# EAGLE design baby_monitor_v1 (EAGLE 9.6.2)

## Sheet 1 of 2: Power & antenna
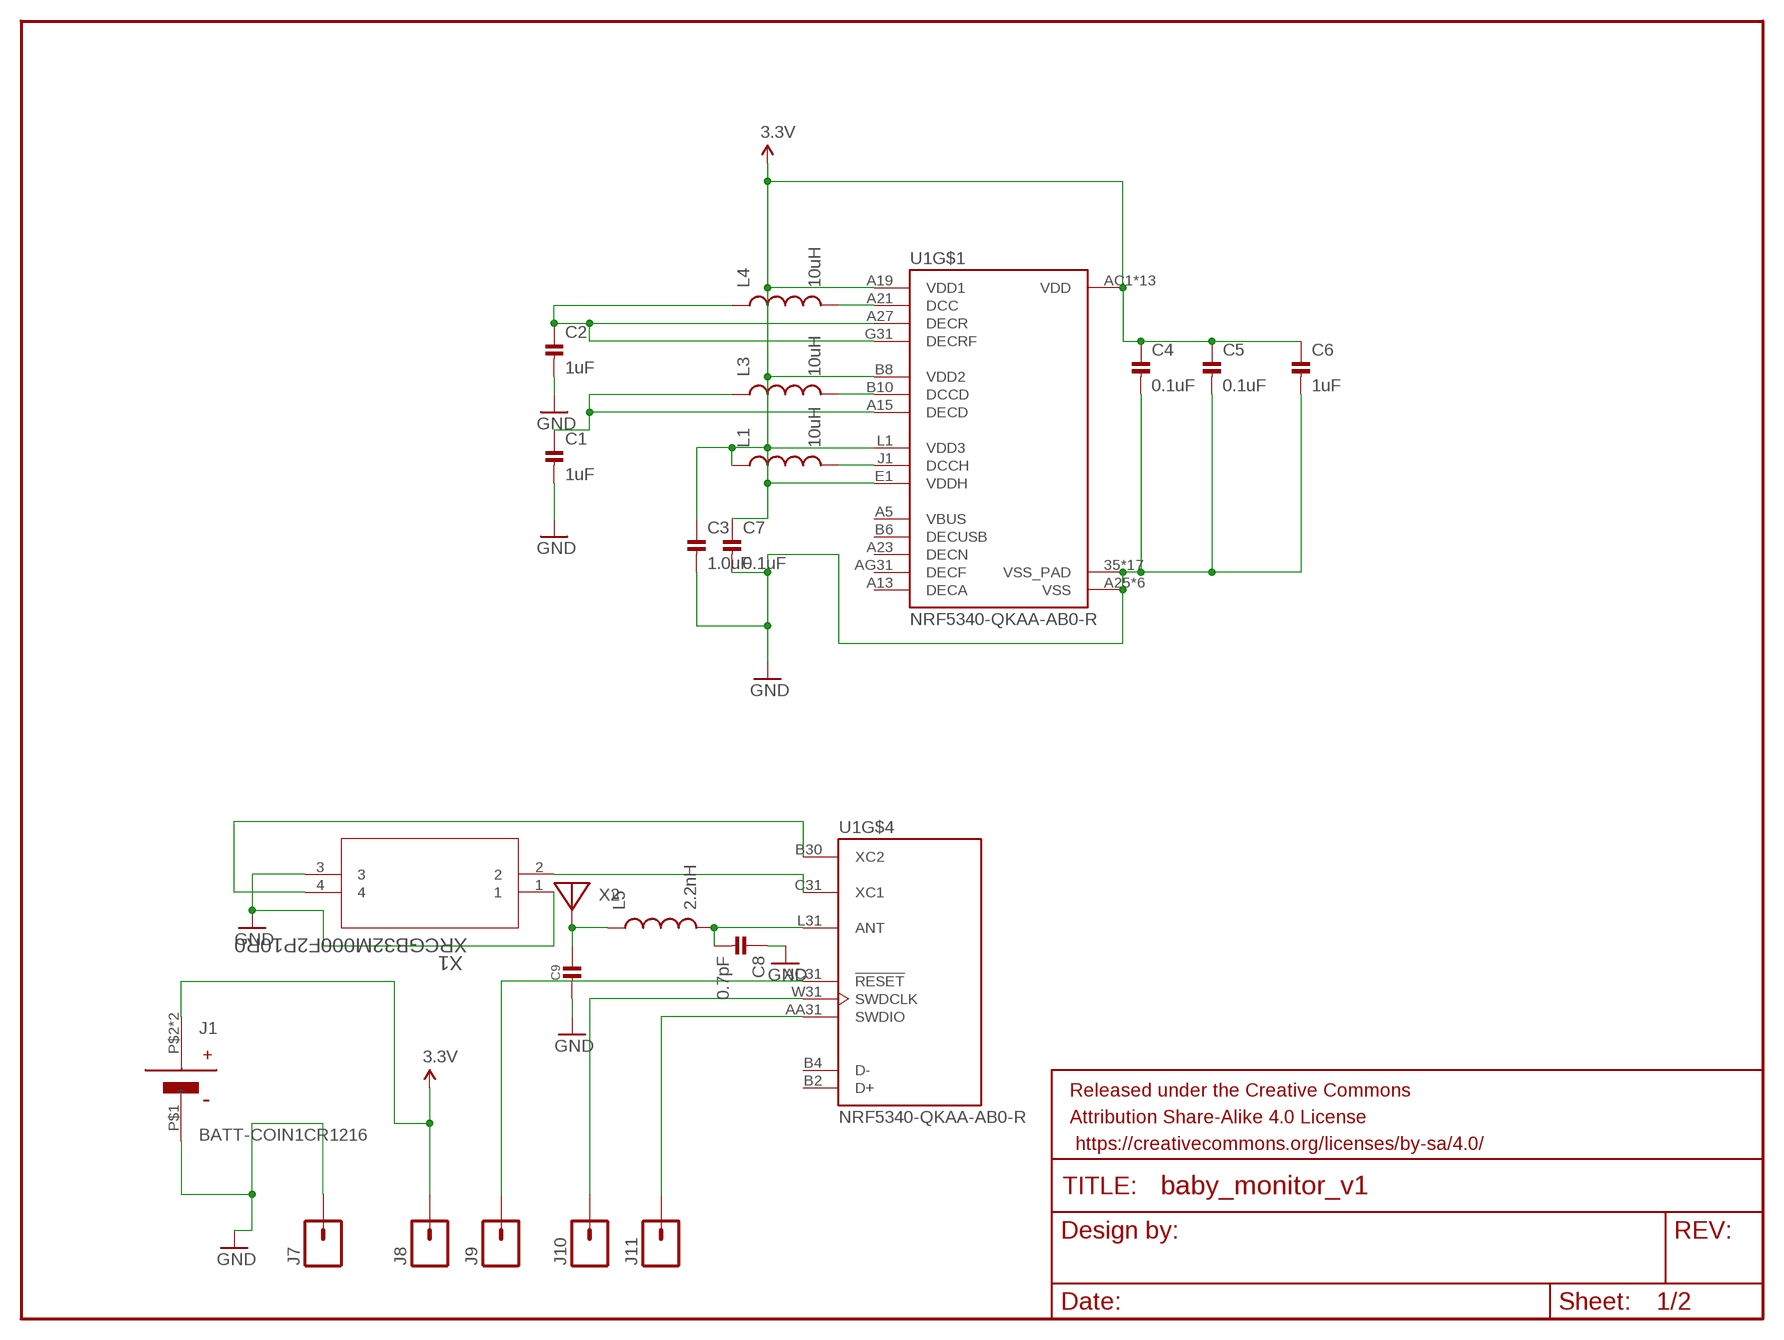
[diagram p0: schematic, sheet 1]

### Parts
C1  1uF  MICROBUILDER_CAP_CERAMIC_0402MP  [MICROBUILDER__0402MP]
C2  1uF  MICROBUILDER_CAP_CERAMIC_0402MP  [MICROBUILDER__0402MP]
C3  1.0uF  MICROBUILDER_CAP_CERAMIC_0402MP  [MICROBUILDER__0402MP]
C4  0.1uF  MICROBUILDER_CAP_CERAMIC_0402MP  [MICROBUILDER__0402MP]
C5  0.1uF  MICROBUILDER_CAP_CERAMIC_0402MP  [MICROBUILDER__0402MP]
C6  1uF  MICROBUILDER_CAP_CERAMIC_0402MP  [MICROBUILDER__0402MP]
C7  0.1uF  MICROBUILDER_CAP_CERAMIC_0402MP  [MICROBUILDER__0402MP]
C8  0.7pF  MICROBUILDER_CAP_CERAMIC_0402MP  [MICROBUILDER__0402MP]
C9  MICROBUILDER_CAP_CERAMIC_0402MP  [MICROBUILDER__0402MP]
FRAME1  FRAME-LETTERNO_PACKAGE  [DUMMY]
J1  BATT-COIN1CR1216  [BC-2017-TR]
J7  M01TINY  [1X01_TINY]
J8  M01TINY  [1X01_TINY]
J9  M01TINY  [1X01_TINY]
J10  M01TINY  [1X01_TINY]
J11  M01TINY  [1X01_TINY]
L1  10uH  NORDIC_MISC_INDUCTOR_0603_N  [NORDIC_MISC_RESC0603_N]
L3  10uH  NORDIC_MISC_INDUCTOR_0603_N  [NORDIC_MISC_RESC0603_N]
L4  10uH  NORDIC_MISC_INDUCTOR_0603_N  [NORDIC_MISC_RESC0603_N]
L5  2.2nH  NORDIC_MISC_INDUCTOR_0402_N  [NORDIC_MISC_RESC0402_N]
U1  NRF5340-QKAA-AB0-R  [XCVR_NRF5340-QKAA-AB0-R]
X1  XRCGB32M000F2P10R0  [XTAL_SON4_1P6X2P0_MUR]
X2  ADAFRUIT_WIRELESS_ANTENNA_JOHANSON_2450AT18B100  [ADAFRUIT_WIRELESS_ANT_2450AT18B100]

### Nets
3.3V: C3.1 C4.1 C5.1 C6.1 C7.1 J1.P$2(+) J1.P$3(+) J8.P$1 L1.1 U1.A19(VDD1) U1.AC1(VDD) U1.AG1(VDD) U1.AJ31(VDD) U1.AL3(VDD) U1.AL7(VDD) U1.AL11(VDD) U1.AL17(VDD) U1.AL25(VDD) U1.B8(VDD2) U1.B28(VDD) U1.C1(VDD) U1.E1(VDDH) U1.E31(VDD) U1.L1(VDD3) U1.N31(VDD) U1.U1(VDD) ; also sheet 2
GND: C1.2 C2.2 C3.2 C4.2 C5.2 C6.2 C7.2 C8.1 C9.2 J1.P$1(-) J7.P$1 U1.35(VSS_PAD) U1.36(VSS_PAD) U1.37(VSS_PAD) U1.38(VSS_PAD) U1.39(VSS_PAD) U1.40(VSS_PAD) U1.41(VSS_PAD) U1.43(VSS_PAD) U1.44(VSS_PAD) U1.45(VSS_PAD) U1.46(VSS_PAD) U1.47(VSS_PAD) U1.48(VSS_PAD) U1.49(VSS_PAD) U1.50(VSS_PAD) U1.51(VSS_PAD) U1.104(VSS_PAD) U1.A25(VSS) U1.B12(VSS) U1.B26(VSS) U1.G1(VSS) U1.H2(VSS) U1.J31(VSS) X1.1 X1.3 ; also sheet 2
N$4: L4.2 U1.A21(DCC)
N$5: L1.2 U1.J1(DCCH)
N$7: L3.2 U1.B10(DCCD)
N$8: C2.1 L4.1 U1.A27(DECR) U1.G31(DECRF)
N$9: C1.1 L3.1 U1.A15(DECD)
N$10: U1.C31(XC1) X1.2
N$11: U1.B30(XC2) X1.4
N$12: C8.2 L5.2 U1.L31(ANT)
N$13: C9.1 L5.1 X2.FP
RESET: J9.P$1 U1.AC31(!RESET)
SWDCLK: J10.P$1 U1.W31(SWDCLK)
SWDIO: J11.P$1 U1.AA31(SWDIO)
Unconnected: U1.B2(D+) U1.B4(D-)

## Sheet 2 of 2: Peripheral
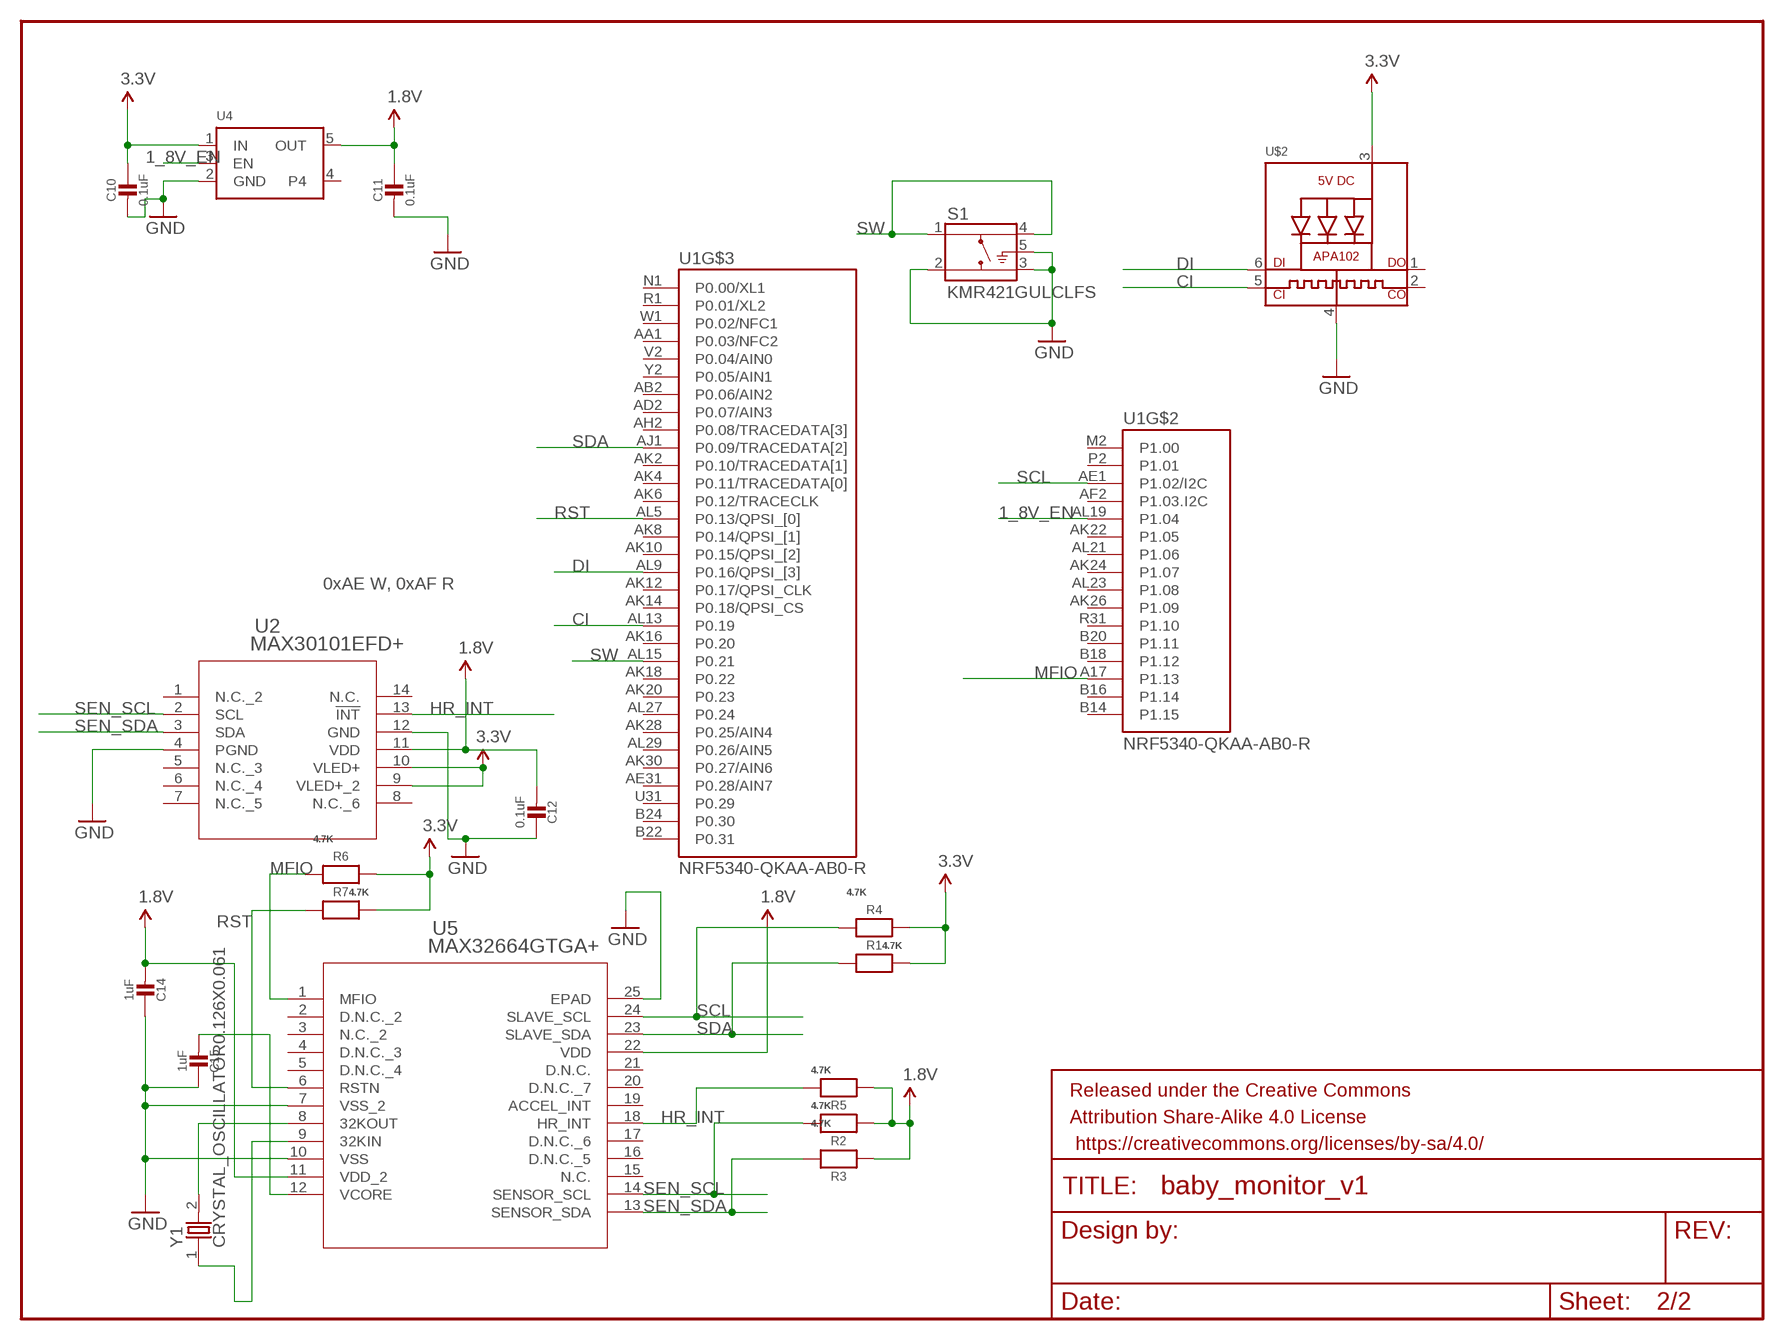
[diagram p1: schematic, sheet 2]

### Parts
C10  0.1uF  MICROBUILDER_CAP_CERAMIC_0402MP  [MICROBUILDER__0402MP]
C11  0.1uF  MICROBUILDER_CAP_CERAMIC_0402MP  [MICROBUILDER__0402MP]
C12  0.1uF  MICROBUILDER_CAP_CERAMIC_0402MP  [MICROBUILDER__0402MP]
C14  1uF  MICROBUILDER_CAP_CERAMIC_0402MP  [MICROBUILDER__0402MP]
C15  1uF  MICROBUILDER_CAP_CERAMIC_0402MP  [MICROBUILDER__0402MP]
FRAME2  FRAME-LETTERNO_PACKAGE  [DUMMY]
R1  4.7K  MICROBUILDER_RESISTOR_0402MP  [MICROBUILDER__0402MP]
R2  4.7K  MICROBUILDER_RESISTOR_0402MP  [MICROBUILDER__0402MP]
R3  4.7K  MICROBUILDER_RESISTOR_0402MP  [MICROBUILDER__0402MP]
R4  4.7K  MICROBUILDER_RESISTOR_0402MP  [MICROBUILDER__0402MP]
R5  4.7K  MICROBUILDER_RESISTOR_0402MP  [MICROBUILDER__0402MP]
R6  4.7K  MICROBUILDER_RESISTOR_0402MP  [MICROBUILDER__0402MP]
R7  4.7K  MICROBUILDER_RESISTOR_0402MP  [MICROBUILDER__0402MP]
S1  KMR421GULCLFS  [SW_KMR421GULCLFS]
U2  MAX30101EFD+  [21-0880B_MXM]
U4  MICROBUILDER_VREG_SOT23-5  [MICROBUILDER_SOT23-5]
U5  MAX32664GTGA+  [21-100264_90-100089_MXM]
U$2  MICROBUILDER_APA1022020  [MICROBUILDER_APA102_2020]
Y1  CRYSTAL_OSCILLATOR0.126X0.061  [QUARTZ]

### Nets
1.8V: C11.1 C12.2 C14.2 R2.1 R3.1 R5.1 U2.11(VDD) U4.5(OUT) U5.11(VDD_2) U5.22(VDD)
1_8V_EN: U1.AL19(P1.04) U4.3(EN)
3.3V: C10.1 R1.2 R4.2 R6.2 R7.2 U2.9(VLED+_2) U2.10(VLED+) U4.1(IN) U$2.3(VDD) ; also sheet 1
CI: U1.AL13(P0.19) U$2.5(CKI)
DI: U1.AL9(P0.16/QPSI_[3]) U$2.6(DI)
GND: C10.2 C11.2 C12.1 C14.1 C15.1 S1.2 S1.3 S1.5(G) U2.4(PGND) U2.12(GND) U4.2(GND) U5.7(VSS_2) U5.10(VSS) U5.25(EPAD) U$2.4(GND) ; also sheet 1
HR_INT: R5.2 U2.13(!INT) U5.18(HR_INT)
MFIO: R6.1 U1.A17(P1.13) U5.1(MFIO)
N$14: C15.2 U5.12(VCORE)
N$15: U5.8(32KOUT) Y1.2
N$16: U5.9(32KIN) Y1.1
RST: R7.1 U1.AL5(P0.13/QPSI_[0]) U5.6(RSTN)
SCL: R4.1 U1.AE1(P1.02/I2C) U5.24(SLAVE_SCL)
SDA: R1.1 U1.AJ1(P0.09/TRACEDATA[2]) U5.23(SLAVE_SDA)
SEN_SCL: R2.2 U2.2(SCL) U5.14(SENSOR_SCL)
SEN_SDA: R3.2 U2.3(SDA) U5.13(SENSOR_SDA)
SW: S1.1 S1.4 U1.AL15(P0.21)
Unconnected: U1.AA1(P0.03/NFC2) U1.AB2(P0.06/AIN2) U1.AD2(P0.07/AIN3) U1.AE31(P0.28/AIN7) U1.AF2(P1.03.I2C) U1.AH2(P0.08/TRACEDATA[3]) U1.AK2(P0.10/TRACEDATA[1]) U1.AK4(P0.11/TRACEDATA[0]) U1.AK6(P0.12/TRACECLK) U1.AK8(P0.14/QPSI_[1]) U1.AK10(P0.15/QPSI_[2]) U1.AK12(P0.17/QPSI_CLK) U1.AK14(P0.18/QPSI_CS) U1.AK16(P0.20) U1.AK18(P0.22) U1.AK20(P0.23) U1.AK22(P1.05) U1.AK24(P1.07) U1.AK26(P1.09) U1.AK28(P0.25/AIN4) U1.AK30(P0.27/AIN6) U1.AL21(P1.06) U1.AL23(P1.08) U1.AL27(P0.24) U1.AL29(P0.26/AIN5) U1.B14(P1.15) U1.B16(P1.14) U1.B18(P1.12) U1.B20(P1.11) U1.B22(P0.31) U1.B24(P0.30) U1.M2(P1.00) U1.N1(P0.00/XL1) U1.P2(P1.01) U1.R1(P0.01/XL2) U1.R31(P1.10) U1.U31(P0.29) U1.V2(P0.04/AIN0) U1.W1(P0.02/NFC1) U1.Y2(P0.05/AIN1) U2.1(N.C._2) U2.5(N.C._3) U2.6(N.C._4) U2.7(N.C._5) U2.8(N.C._6) U2.14(N.C.) U4.4 U5.2(D.N.C._2) U5.3(N.C._2) U5.4(D.N.C._3) U5.5(D.N.C._4) U5.15(N.C.) U5.16(D.N.C._5) U5.17(D.N.C._6) U5.19(ACCEL_INT) U5.20(D.N.C._7) U5.21(D.N.C.) U$2.1(DO) U$2.2(CKO)

### Notes on the sheet
- 0xAE W, 0xAF R

## Power pins joined to a net without a drawn wire
DECA: U1.A13(DECA)
DECF: U1.AG31(DECF)
DECN: U1.A23(DECN)
DECUSB: U1.B6(DECUSB)
VBUS: U1.A5(VBUS)

## Library data of the parts
C1-C8 C10-C12 C14 C15 = Adafruit Circuit Playground Bluefruit:MICROBUILDER_CAP_CERAMIC: Ceramic Capacitors For new designs, use the packages preceded by an '_' character since they are more reliable: The following footprints should be used on most boards: _0402 - Standard footprint for regular board layouts _0603 - Standard footprint for regular board layouts _0805 - Standard footprint for regular board layouts _1206 - Standard footprint for regular board layouts For extremely tight-pitch boards where space is at a premium, the following 'micro-pitch' footprints can be used (smaller pads, no silkscreen outline, etc.): _0402MP - Micro-pitch footprint for very dense/compact boards _0603MP - Micro-pitch footprint for very dense/compact boards _0805MP - Micro-pitch footprint for very dense/compact boards _1206MP - Micro-pitch footprint for very dense/compact boards
C9 = graftel-internal-ic:MICROBUILDER_CAP_CERAMIC: Ceramic Capacitors For new designs, use the packages preceded by an '_' character since they are more reliable: The following footprints should be used on most boards: _0402 - Standard footprint for regular board layouts _0603 - Standard footprint for regular board layouts _0805 - Standard footprint for regular board layouts _1206 - Standard footprint for regular board layouts For extremely tight-pitch boards where space is at a premium, the following 'micro-pitch' footprints can be used (smaller pads, no silkscreen outline, etc.): _0402MP - Micro-pitch footprint for very dense/compact boards _0603MP - Micro-pitch footprint for very dense/compact boards _0805MP - Micro-pitch footprint for very dense/compact boards _1206MP - Micro-pitch footprint for very dense/compact boards
FRAME1 FRAME2 = SparkFun-Aesthetics:FRAME-LETTER: Schematic Frame Standard 8.5x11 US Letter frame; DESIGNER: Nobody; VERSION: v01
J1 = graftel-internal-ic:BATT-COIN1: Digikey Part Number: BLP2032SM-GCT-ND link:https://www.digikey.com/product-detail/en/mpd-memory-protection-devices/BLP2032SM-GTR/BLP2032SM-GCT-ND/3628537
J7-J11 = graftel-internal-ic:M01: Header 1 Standard 1-pin 0.1" header. Use with straight break away headers (SKU : PRT-00116), right angle break away headers (PRT-00553), swiss pins (PRT-00743), machine pins (PRT-00117), and female headers (PRT-00115). SMTSO-256-ET is a "flush mount" nut for a 4-40 screw. The older package used to be too tight, and did not allow it to sit properly thru the drill hit. The latest (0.165DIA) fits nice and snug.
L1 L3-L5 = Adafruit Circuit Playground Bluefruit:NORDIC_MISC_INDUCTOR: Generic chip inductor
R1-R7 = Adafruit Circuit Playground Bluefruit:MICROBUILDER_RESISTOR: Resistors For new designs, use the packages preceded by an '_' character since they are more reliable: The following footprints should be used on most boards: _0402 - Standard footprint for regular board layouts _0603 - Standard footprint for regular board layouts _0805 - Standard footprint for regular board layouts _1206 - Standard footprint for regular board layouts For extremely tight-pitch boards where space is at a premium, the following 'micro-pitch' footprints can be used (smaller pads, no silkscreen outline, etc.): _0402MP - Micro-pitch footprint for very dense/compact boards _0603MP - Micro-pitch footprint for very dense/compact boards _0805MP - Micro-pitch footprint for very dense/compact boards _1206MP - Micro-pitch footprint for very dense/compact boards
S1 = graftel-internal-ic:KMR421GULCLFS: Switch Tactile N.O. SPST Round Button Gull Wing 0.05A 32VDC 1VA 200000Cycles 2N SMD Automotive T/R; DESCRIPTION: Tactile Switch SPST-NO Top Actuated Surface Mount; DIGI-KEY_PART_NUMBER: CKN12152CT-ND; MF: C&K; MP: KMR421GULCLFS; PACKAGE: None; PURCHASE-URL: https://pricing.snapeda.com/search/part/KMR421GULCLFS/?ref=eda
U1 = graftel-internal-ic:NRF5340-QKAA-AB0-R: IC RF; AVAILABILITY: Unavailable; DESCRIPTION: IC RF TxRx + MCU 802.15.4, Bluetooth Bluetooth v5.1, Thread, Zigbee® 2.4GHz; MF: Nordic Semiconductor; MP: nRF5340-QKAA-AB0-R; PACKAGE: None; PRICE: None
U2 = graftel-internal-ic:MAX30101EFD+; BUILT_BY: EMA_UL_Team; MANUFACTURER_PART_NUMBER: MAX30101EFD+; SOURCELIBRARY: Update_to_database_2021-01-13; VENDOR: Maxim Integrated Products
U4 = Adafruit Circuit Playground Bluefruit:MICROBUILDER_VREG_SOT23-5: SOT23-5 Fixed Voltage Regulators Part Current Out V Out V In V Dropout θJA (°C/W) TJ (°C) Digikey Part No. ADP121 150mA 3.3V 3.4-5.5V 0.09V @ 150mA -- -- ADP121-AUJZ33R7CT-ND ADP121 150mA 3.0V 3.1-5.5V 0.09V @ 150mA -- -- ADP121-AUJZ30R7CT-ND ADP122 300mA 3.3V 3.4-5.5V 0.085V @ 300mA -- -- ADP122AUJZ-3.3-R7CT-ND ADP1712 300mA 3.3V 3.5-5.5V 0.17V @ 300mA -- -- ADP1712AUJZ-3.3-R7TR-ND AP7311 (Low Cost) 150mA 3.3V 3.5-6V 0.15V @ 150mA -- -- AP7311-33WG-7DICT-ND LD39015M18R 150mA 1.8V 1.9V-5.5V 0.08V @ 100mA -- -- 497-6977-1-ND LP2985A-33DBVR 150mA 3.3V 3.3-16V 0.28V @ 150mA 206 150 296-18479-1-ND MCP1824T-3302E/OT 300mA 3.3V 3.5V-6V 0.2V @ 300mA -- -- MCP1824T-3302E/OTCT-ND MIC5205-2.5YM5 TR 150mA 2.5V 2.7-16V 0.165V @ 150mA -- -- 576-1257-2-ND MIC5205-3.0YM5 TR 150mA 3.0V 3.2V-16V 0.165V @ 150mA -- -- 576-1258-2-ND MIC5205-3.3YM5 TR 150mA 3.3V 3.5V-16V 0.165V @ 150mA -- -- 576-1259-2-ND TPS780330220 150mA 3.3V+2.2V 3.6-5.5V 250mV Max -- -- 296-23332-1-ND TDA3663/N1,135 100mA 3.3V 3.5-45V 0.18V @ 50mA -- -- 568-5343-1-ND Max operating temp can be calculated using θJA, TJ (max junction temperature), and power in watts. Set the "Maximum Ambient Temperature" until it reaches TJ ("Max Junction Temperature"), which is the absolute limit for safe use of the regulator: Heat Sink Temperature Calculator <http://www.daycounter.com/Calculators/Heat-Sink-Temperature-Calculator.phtml> For example, With 12V source into a 3.3V LP2985 and a 30mA load, we are dissipating (12V-3.3V) * 0.03A = 0.261W. With a θJA of 206 °C/W, a TJ of 150°C, and 261mW we can safely use the chip without a heat sink up to 75°C (=147.1°C Junction Temperature).
U5 = graftel-internal-ic:MAX32664GTGA+; BUILT_BY: EMA_Rebekah; COPYRIGHT: Copyright (C) 2018 Accelerated Designs. All rights reserved; MANUFACTURER_PART_NUMBER: MAX32664GTGA+; REVISION: 2; SOURCELIBRARY: Maxim_2020-02-10; VENDOR: Maxim Integrated Products
U$2 = graftel-internal-ic:MICROBUILDER_APA102: APA102/DotStar Pixels VCC: 5V DC Refresh Rate: 400Hz
X1 = graftel-internal-ic:XRCGB32M000F2P10R0; BUILT_BY: EMA_UL_Team; DIGIKEY_PART: 490-14308-1-ND; MANUFACTURER_PART_NUMBER: XRCGB32M000F2P10R0; SOURCELIBRARY: Murata_2017-08-09; VENDOR: Murata
X2 = graftel-internal-ic:ADAFRUIT_WIRELESS_ANTENNA_JOHANSON_2450AT18B100: Johanson 2.4GHz Chip Antenna (1206 Package) Frequency Range: 2400 - 2500 Mhz Peak Gain 0.5 dBi typ. (XZ-V) Average Gain -0.5 dBi typ. (XZ-V) Input Power 3W max. Operating Temperature -40 to +85°C Digikey: 712-1006-1-ND; DIGIKEY_PART: 712-1006-1-ND
Y1 = graftel-internal-ic:CRYSTAL_OSCILLATOR: SER4072CT-ND; PARTNO: SER4072CT-ND

## Board
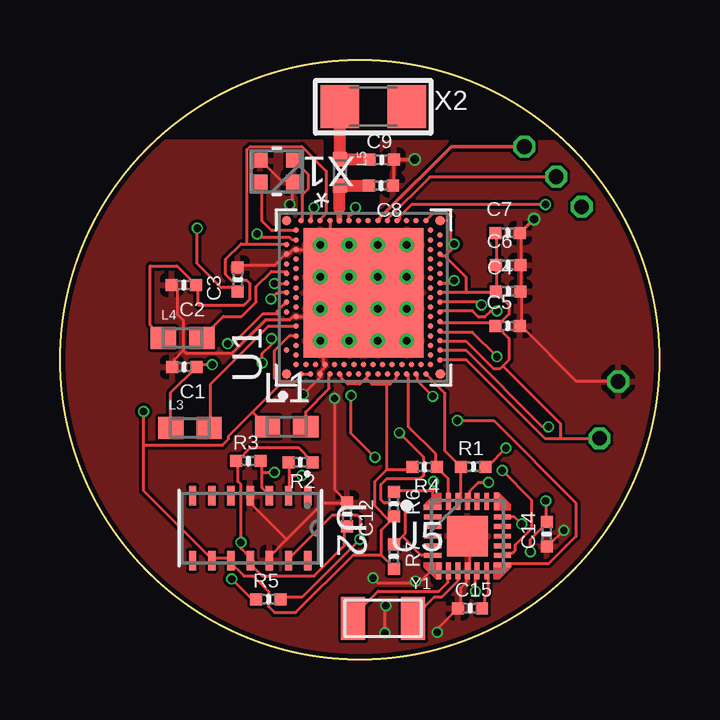
[diagram p2: board, top side]
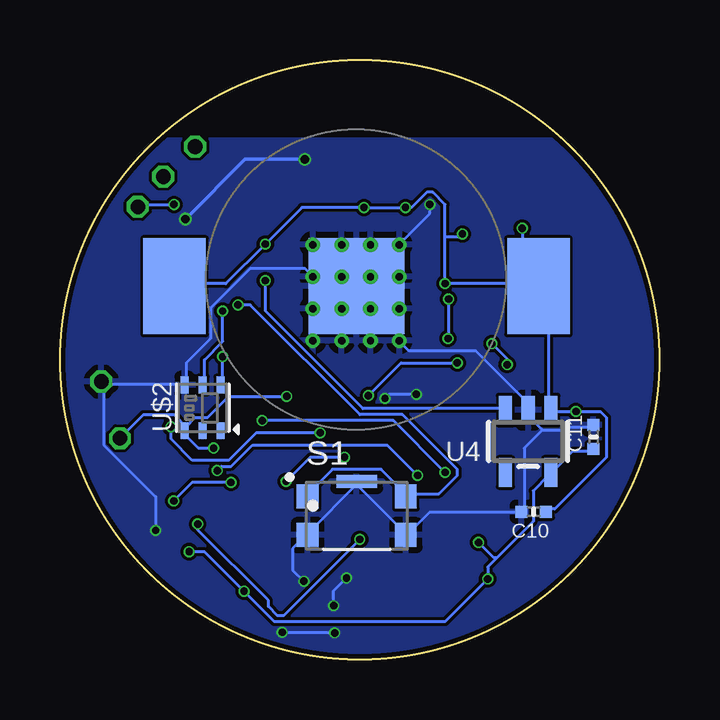
[diagram p3: board, bottom side, seen from below]

Size 25 x 25 mm. Coordinates in mm from the lower left corner, seen from the top.
Outline: circle at 12.5,12.5 radius 12.5
Copper layers (1*16): Top 0.035559375mm / dielectric 1.6mm / Bottom 0.035559375mm
Design rules "jlcpcb2layer": minimum track width 5mil, minimum drill 12mil, track to track 5mil, track to pad 5mil, pad to pad 5mil, via to via 5mil, smd to smd 5mil, copper to edge 8mil, drill to drill 6mil, minimum pad ring 5mil, minimum via ring 3mil, stop-mask expansion 2.5mil, vias tented up to drill 0mil, thermal gap 10mil

### Footprints (pad centres in the part's own frame; a part is rotated, then mirrored left to right if it is on the bottom)
MICROBUILDER__0402MP = smd 0.5 x 0.5: 1 -0.508,0; 2 0.508,0
BC-2017-TR = smd 4 x 4: P$1 0,0 | smd 2.6 x 4: P$2 -7.59,0; P$3 7.59,0
1X01_TINY = drill 0.61 octagon: P$1 0,0
NORDIC_MISC_RESC0603_N = smd 1.05 x 0.9: 1 -0.8,0; 2 0.8,0
NORDIC_MISC_RESC0402_N = smd 0.6 x 0.6: 1 -0.55,0; 2 0.55,0
SW_KMR421GULCLFS = smd 0.9 x 1: 1 -2.05,0.8; 2 -2.05,-0.8; 3 2.05,-0.8; 4 2.05,0.8 | smd 1.7 x 0.55: 5 0,1.425
XCVR_NRF5340-QKAA-AB0-R = drill 0.305 pad 0.61: 35 -1.8,-1.8; 36 -0.467,-1.8; 37 0.867,-1.8; 38 2.2,-1.8; 39 -1.8,-0.6; 40 -0.467,-0.6; 41 0.867,-0.6; 43 2.2,-0.6; 44 -1.8,0.6; 45 -0.467,0.6; 46 0.867,0.6; 47 2.2,0.6; 48 -1.8,1.8; 49 -0.467,1.8; 50 0.867,1.8; 51 2.2,1.8 | smd 5.4 x 5: 104 0.2,0 | smd 0.4 x 0.4: A1 -3.2,3.2; A31 3.2,3.2; AL1 -3.2,-3.2; AL31 3.2,-3.2 | smd 0.225 x 0.225: A5 -2.2,3.2; A13 -0.6,3.2; A15 -0.2,3.2; A17 0.2,3.2; A19 0.6,3.2; A21 1,3.2; A23 1.4,3.2; A25 1.8,3.2; A27 2.2,3.2; AA1 -3.2,-1; AA31 3.2,-1; AB2 -2.8,-1.2; AC1 -3.2,-1.4; AC31 3.2,-1.4; AD2 -2.8,-1.6; AE1 -3.2,-1.8; AE31 3.2,-1.8; AF2 -2.8,-2; AG1 -3.2,-2.2; AG31 3.2,-2.2; AH2 -2.8,-2.4; AJ1 -3.2,-2.6; AJ31 3.2,-2.6; AK2 -2.8,-2.8; AK4 -2.4,-2.8; AK6 -2,-2.8; AK8 -1.6,-2.8; AK10 -1.2,-2.8; AK12 -0.8,-2.8; AK14 -0.4,-2.8; AK16 0,-2.8; AK18 0.4,-2.8; AK20 0.8,-2.8; AK22 1.2,-2.8; AK24 1.6,-2.8; AK26 2,-2.8; AK28 2.4,-2.8; AK30 2.8,-2.8; AL3 -2.6,-3.2; AL5 -2.2,-3.2; AL7 -1.8,-3.2; AL9 -1.4,-3.2; AL11 -1,-3.2; AL13 -0.6,-3.2; AL15 -0.2,-3.2; AL17 0.2,-3.2; AL19 0.6,-3.2; AL21 1,-3.2; AL23 1.4,-3.2; AL25 1.8,-3.2; AL27 2.2,-3.2; AL29 2.6,-3.2; B2 -2.8,2.8; B4 -2.4,2.8; B6 -2,2.8; B8 -1.6,2.8; B10 -1.2,2.8; B12 -0.8,2.8; B14 -0.4,2.8; B16 0,2.8; B18 0.4,2.8; B20 0.8,2.8; B22 1.2,2.8; B24 1.6,2.8; B26 2,2.8; B28 2.4,2.8; B30 2.8,2.8; C1 -3.2,2.6; C31 3.2,2.6; D2 -2.8,2.4; E1 -3.2,2.2; E31 3.2,2.2; F2 -2.8,2; G1 -3.2,1.8; G31 3.2,1.8; H2 -2.8,1.6; J1 -3.2,1.4; J31 3.2,1.4; K2 -2.8,1.2; L1 -3.2,1; L31 3.2,1; M2 -2.8,0.8; N1 -3.2,0.6; N31 3.2,0.6; P2 -2.8,0.4; R1 -3.2,0.2; R31 3.2,0.2; T2 -2.8,0; U1 -3.2,-0.2; U31 3.2,-0.2; V2 -2.8,-0.4; W1 -3.2,-0.6; W31 3.2,-0.6; Y2 -2.8,-0.8
21-0880B_MXM = smd 0.813 x 0.305: 1 -1.346,2.4; 2 -1.346,1.6; 3 -1.346,0.8; 4 -1.346,0; 5 -1.346,-0.8; 6 -1.346,-1.6; 7 -1.346,-2.4; 8 1.346,-2.4; 9 1.346,-1.6; 10 1.346,-0.8; 11 1.346,0; 12 1.346,0.8; 13 1.346,1.6; 14 1.346,2.4
MICROBUILDER_SOT23-5 = smd 0.55 x 1.2: 1 -0.95,-1.3; 2 0,-1.3; 3 0.95,-1.3; 4 0.95,1.3; 5 -0.95,1.3
21-100264_90-100089_MXM = smd 0.711 x 0.203: 1 -1.45,1.2; 2 -1.45,0.8; 3 -1.45,0.4; 4 -1.45,0; 5 -1.45,-0.4; 6 -1.45,-0.8; 13 1.45,-1.2; 14 1.45,-0.8; 15 1.45,-0.4; 16 1.45,0; 17 1.45,0.4; 18 1.45,0.8 | smd 0.203 x 0.711: 7 -1.2,-1.45; 8 -0.8,-1.45; 9 -0.4,-1.45; 10 0,-1.45; 11 0.4,-1.45; 12 0.8,-1.45; 19 1.2,1.45; 20 0.8,1.45; 21 0.4,1.45; 22 0,1.45; 23 -0.4,1.45; 24 -0.8,1.45 | smd 1.702 x 1.702: 25 0,0
MICROBUILDER_APA102_2020 = smd 0.7 x 0.35: 1 -0.95,-0.75; 2 -0.95,0; 3 -0.95,0.75; 4 0.95,0.75; 5 0.95,0; 6 0.95,-0.75
XTAL_SON4_1P6X2P0_MUR = smd 0.61 x 0.61: 1 -0.699,0.45; 2 -0.699,-0.45; 3 0.699,-0.45; 4 0.699,0.45
ADAFRUIT_WIRELESS_ANT_2450AT18B100 = smd 1.6 x 1.8: FP -1.4,0; NC 1.4,0
QUARTZ = smd 1 x 1.8: 1 -1.25,0; 2 1.25,0

### Placement (x,y rotation side)
C1  5.19,12.2 180 top
C2  5.17,15.62 180 top
C3  7.41,15.84 90 top
C4  18.69,15.35 0 top
C5  18.67,13.91 0 top
C6  18.68,16.45 0 top
C7  18.67,17.79 0 top
C8  13.39,19.76 180 top
C9  13.41,20.84 0 top
C10  5.25,6.16 180 bottom
C11  2.76,9.28 90 bottom
C12  11.97,6.05 270 top
C14  20.3,5.24 90 top
C15  17.09,2.14 0 top
FRAME1  6.66,-19.25 0 top  (outside the outline)
FRAME2  5.64,-20.27 0 top  (outside the outline)
J1  12.64,15.57 0 bottom
J7  23.27,11.59 0 top
J8  22.5,9.23 0 top
J9  21.76,18.88 0 top
J10  19.36,21.39 0 top
J11  20.69,20.14 0 top
L1  9.45,9.71 0 top
L3  5.42,9.66 0 top
L4  5.11,13.41 0 top
L5  11.68,20.31 270 top
R1  17.23,8.04 0 top
R2  10.03,8.23 180 top
R3  7.85,8.28 0 top
R4  15.2,8.03 180 top
R5  8.69,2.52 0 top
R6  13.92,6.48 270 top
R7  13.92,4.3 270 top
S1  12.63,6 0 bottom
U1  12.65,15.1 90 top
U2  7.93,5.48 270 top
U4  5.48,9.1 180 bottom
U5  16.99,5.15 0 top
U$2  19.05,10.49 90 bottom
X1  9.04,20.36 180 top
X2  13.06,23.05 0 top
Y1  13.47,1.72 180 top

### Tracks (layer width: path | path; a pad name or v marks a point on that pad's centre or on a via)
1.8V  (via drill 0.3)
  Top 0.127: R2.1 10.47,8.31 9.96,8.82 7.93,8.82 7.42,8.31 R3.1 7.42,8.18 7.42,7.42 7.55,7.29 v7.55,4.88 7.55,4.63 7.93,4.25 U2.11 8.05,4.12 8.05,3.86 8.44,3.48 10.6,3.48 11.87,4.75 11.87,5.52 C12.2 | v7.17,3.36 7.93,2.59 8.18,2.59 R5.1 | v17.33,2.85 17.33,3.61 U5.11 | v19.61,4.5 19.61,5.01 20.25,5.64 C14.2 20.25,5.77 v20.25,6.62 | U5.22 17.1,6.71 17.1,7.03 17.45,7.39 v17.87,7.39
  Bottom 0.127: 6.79,4.25 5.26,5.77 5.26,7.04 4.63,7.67 U4.5 4.5,7.8 3.61,8.69 2.85,8.69 C11.1 | 6.79,4.25 7.17,3.86 v7.17,3.36 8.94,1.58 16.06,1.58 v17.33,2.85 18.98,4.5 v19.61,4.5 | v7.55,4.88 6.91,4.25 6.79,4.25 | v17.87,7.39 19.48,7.39 v20.25,6.62
1_8V_EN  (via drill 0.3)
  Top 0.127: v16.44,15.8 16.31,15.68 15.93,15.68 U1.AL19
  Bottom 0.127: v16.44,15.8 16.44,14.53 12.37,10.47 6.53,10.47 U4.3
3.3V  (via drill 0.3)
  Top 0.127: 12.75,11.74 12.88,11.87 U1.U1 | 12.75,11.74 12.5,11.48 11.99,11.48 11.74,11.74 11.74,11.87 11.71,11.9 U1.L1 | 13.64,11.48 13.01,11.48 12.75,11.74 | 13.64,11.48 13.77,11.48 14.02,11.74 14.02,11.87 U1.AC1 | 13.39,4.37 13.9,3.86 R7.2 | 13.39,4.37 13.39,5.39 13.77,5.77 | 13.77,5.77 13.9,5.9 R6.2 13.77,5.77 | 13.64,7.93 14.66,7.93 R4.2 | 13.64,7.93 13.14,7.42 13.14,6.4 13.77,5.77 | 13.64,7.93 13.64,11.48 | 9.2,11.48 8.94,11.74 8.94,12.88 9.58,13.52 9.83,13.52 U1.B8 | 9.2,11.48 9.71,11.48 10.09,11.87 U1.C1 U1.E1 | 3.48,8.94 3.48,7.04 6.28,4.25 U2.9 6.4,4.25 7.04,4.25 U2.10 7.04,4.12 7.67,3.48 8.05,3.48 8.69,2.85 8.69,2.21 8.94,1.96 9.83,1.96 12.25,4.37 13.39,4.37 | 3.48,8.94 v3.48,10.34 | 8.08,10.37 7.04,9.32 7.04,9.2 6.79,8.94 3.48,8.94 | 8.08,10.37 9.2,11.48 | 18.47,12.25 18.72,12.5 18.72,13.39 18.21,13.9 C5.1 | 18.47,12.25 18.34,12.12 18.09,12.12 16.95,13.26 15.93,13.26 U1.AL7 | U1.AL11 15.93,14.02 18.09,14.02 C5.1 | 16.95,15.29 18.09,15.29 C4.1 | 16.95,15.29 15.93,15.29 U1.AL17 | 16.06,16.82 15.93,16.82 U1.AL25 | 16.06,16.82 16.95,15.93 16.95,15.29 | 16.31,17.33 16.31,17.07 16.06,16.82 | 16.31,17.33 16.31,18.47 16.06,18.72 15.68,18.72 15.29,18.34 U1.AJ31 | C4.1 18.21,15.42 18.21,16.44 C6.1 18.21,16.56 18.21,17.71 C7.1 | C5.1 18.21,14.02 18.34,14.02 18.72,14.41 18.72,14.79 18.21,15.29 C4.1 | v15.55,10.98 14.91,11.61 14.91,11.87 U1.AG1 | v18.6,8.82 17.83,8.05 R1.2 | 20.88,9.2 22.41,9.2 J8.P$1 | 20.88,9.2 20.25,9.2 16.95,12.5 15.93,12.5 U1.AL3 | 18.47,12.25 20.88,9.83 20.88,9.2 | v8.94,15.68 9.45,15.68 U1.A19 | v10.6,18.85 10.47,18.72 10.47,18.34 U1.E31 | v16.44,17.33 16.31,17.33 | U1.B28 9.68,17.5 9.58,17.6 8.37,17.6 v8.22,17.75
  Top 0.127: U1.N31 12.05,18.53 arc90 12.32,18.8 v12.32,18.85 | L1.1 8.08,10.28 8.08,10.37 | C3.1 7.24,15.51 6.73,15.51 5.73,16.51 v5.73,17.98
  Bottom 0.127: v15.55,10.98 17.96,10.98 18.85,10.09 19.36,10.09 19.74,9.71 | 19.74,9.71 19.87,9.58 U$2.3 | v18.6,8.82 19.23,8.82 19.87,9.45 U$2.3 | 19.74,9.71 20.25,10.21 21.52,10.21 22.41,9.32 J8.P$1 | 19.74,9.71 U$2.3 | C10.1 4.63,6.28 4.37,6.28 2.21,8.44 2.21,10.09 2.47,10.34 v3.48,10.34 4.5,10.34 U4.1 4.63,10.47 4.63,15.17 5.01,15.55 J1.P$3 | J1.P$3 5.13,15.68 v8.94,15.68 8.94,17.61 | 8.94,17.61 8.94,18.98 9.45,19.48 9.71,19.48 10.34,18.85 v10.6,18.85 v12.32,18.85 14.91,18.85 v16.44,17.33 18.09,15.68 20.12,15.68 J1.P$2 | v8.22,17.75 8.36,17.61 8.94,17.61 | v5.73,17.98 5.73,16.25 J1.P$3
CI  (via drill 0.3)
  Top 0.127: v18.21,14.53 17.96,14.53 17.71,14.28 17.45,14.28 17.2,14.53 15.93,14.53 U1.AL13
  Bottom 0.127: v18.21,14.53 18.21,13.26 18.98,12.5 18.98,11.48 U$2.5
DI  (via drill 0.3)
  Top 0.127: v18.21,12.63 17.2,13.64 15.93,13.64 U1.AL9
  Bottom 0.127: v18.21,12.63 18.21,11.48 U$2.6
GND  (via drill 0.3, 0.35)
  Top 0.127: v21.01,5.39 20.37,4.75 C14.1 | C8.1 13.9,19.87 13.9,20.75 C9.2 | C7.2 19.23,17.71 19.23,16.56 C6.2 19.23,16.44 19.23,15.42 C4.2 19.23,15.29 19.23,14.02 C5.2 19.23,13.9 21.52,11.61 23.17,11.61 J7.P$1 | U5.25 17.07,5.13 17.07,3.74 U5.10 16.95,3.61 16.95,3.23 16.69,2.98 16.69,2.21 C15.1 15.73,1.29 v15.73,1.13 | U5.7 15.8,3.74 15.52,3.74 14.98,3.2 14.81,3.2 | 9.45,5.01 8.69,4.25 U2.12 | 9.45,5.01 10.98,6.53 11.87,6.53 C12.1 11.45,7.09 v11.45,10.89 | 9.45,5.01 8.05,6.4 8.05,6.79 U2.4 | 5.13,12.88 4.75,12.5 4.75,12.25 C1.2 | 5.13,12.88 5.13,14.15 4.88,14.41 4.88,15.42 4.75,15.55 C2.2 | X1.3 8.44,20.75 9.2,19.99 9.71,19.99 X1.1 9.71,19.87 9.71,19.1 v9.58,18.98 | 9.45,16.95 9.58,16.95 9.71,17.07 9.83,17.07 U1.B26 9.96,17.07 10.72,17.07 10.85,17.2 U1.104 | 10.85,14.53 10.6,14.28 9.96,14.28 U1.B12 9.83,14.28 9.71,14.28 9.58,14.15 8.56,14.15 7.17,12.75 5.26,12.75 5.13,12.88 | 10.98,13.26 10.98,12.37 U1.H2 11.1,12.25 10.85,11.99 U1.G1 10.85,11.77 v10.14,11.06 | 9.45,16.95 8.94,16.44 7.42,16.44 C3.2 | 9.45,16.95 U1.A25 | 10.98,13.26 U1.48 | 10.98,13.26 U1.104 | U1.104 11.48,13.9 11.99,13.39 U1.44 12.12,13.39 13.14,13.39 U1.39 13.26,13.39 14.41,13.39 U1.35 | 10.85,14.53 U1.49 | 10.85,14.53 U1.104 | U1.45 12.12,14.66 U1.104 | U1.104 12.63,15.17 13.14,14.66 U1.40 13.26,14.66 14.41,14.66 U1.36 | U1.50 10.98,16.06 11.48,16.56 U1.104 | U1.46 11.99,16.06 U1.104 | U1.104 10.98,17.33 U1.51 arc90 11.25,17.7 U1.J31 | U1.104 11.48,16.69 11.99,17.2 U1.47 12.12,17.33 13.14,17.33 U1.43 13.26,17.33 14.41,17.33 U1.38 | 13.26,16.06 14.41,16.06 U1.37 | 13.26,16.06 U1.41 | 13.26,16.06 U1.104 | v13.55,1.11 13.55,2.2 v13.59,2.24
  Top 0.127: v13.05,3.4 13.26,3.2 14.81,3.2 | v14.83,3.27 14.83,3.22 14.81,3.2
  Top 0.152: C9.2 14.77,20.84 v14.79,20.86 | v19.76,18.37 19.75,18.37 C7.2
  Bottom 0.127: v21.01,5.39 21.01,6.79 23.17,8.94 23.17,11.48 | 23.17,11.48 19.87,11.48 U$2.4 19.74,11.48 19.74,12.37 18.72,13.39 18.72,14.66 17.07,16.31 14.79,16.31 14.53,16.06 U1.37 | 23.17,11.48 J7.P$1 | 4.88,9.58 4.12,9.58 3.99,9.71 2.85,9.71 C11.2 | 4.88,9.58 5.39,10.09 5.39,10.34 U4.2 5.52,10.47 5.52,10.72 7.67,12.88 10.47,12.88 10.85,13.26 U1.48 | 4.88,9.58 5.64,8.82 5.64,6.28 C10.2 5.77,6.15 9.58,6.15 10.47,5.26 S1.3 10.6,5.26 12.63,7.29 | S1.5 12.63,7.29 | 12.63,7.29 14.66,5.26 S1.2 14.79,5.13 15.29,4.63 15.29,3.73 v14.83,3.27 | U1.41 13.14,15.93 12.75,15.55 J1.P$1 | v9.58,18.98 9.58,18.6 10.85,17.33 U1.51 | v15.73,1.13 13.57,1.13 v13.55,1.11 | v13.59,2.24 13.59,2.87 v13.05,3.4 | v10.14,11.06 11.28,11.06 v11.45,10.89
  Bottom 0.152: v14.79,20.86 17.27,20.86 v19.76,18.37
  pour Top: -0.25,21.64 10.93,21.64 10.93,17.78 12.32,17.78 13.41,17.78 13.41,21.62 27.49,21.62 27.49,-0.35 -0.35,-0.35 -0.35,21.54 -0.35,21.64 -0.28,21.64
  pour Bottom: -0.35,21.69 27.51,21.69 27.51,-0.33 -0.35,-0.33
HR_INT  (via drill 0.3)
  Top 0.127: R5.2 9.2,2.59 10.09,2.59 v12.5,5.01 12.5,5.9 12.37,6.02 11.36,6.02 9.58,4.25 U2.13 | v19.26,5.65 18.96,5.95 U5.18
  Bottom 0.127: v12.5,5.01 15.68,1.83 15.93,1.83 16.31,2.21 16.31,2.47 19.26,5.41 v19.26,5.65
MFIO  (via drill 0.3)
  Top 0.127: v8.82,13.39 8.82,13.13 8.44,12.75 v8.44,12.37 | v12.14,11 12.14,9.43 v13.14,8.44 | 15.55,7.04 15.55,6.4 U5.1 | U1.A17 9.16,15.29 9.12,15.26 9.02,15.26 v8.8,15.03 | 15.55,7.04 14.02,7.04 R6.1 | v15.57,7.43 15.57,7.06 15.55,7.04
  Bottom 0.127: v8.44,12.37 10.77,12.37 v12.14,11 | v8.8,15.03 8.8,13.41 v8.82,13.39 | v15.57,7.43 14.56,8.44 v13.14,8.44
N$4
  Top 0.127: U1.A21 9.45,16.18 8.82,16.18 8.18,15.55 8.18,14.91 7.57,14.3 6.81,14.3 L4.2
N$5
  Top 0.127: U1.J1 11.23,11.87 11.23,11.3 10.25,10.33 L1.2
N$7
  Top 0.127: U1.B10 9.83,13.9 8.69,13.9 6.28,11.48 6.28,9.71 L3.2
N$8
  Top 0.127: 7.8,17.33 7.55,17.33 6.91,16.69 6.91,16.06 7.17,15.8 7.8,15.8 7.93,15.68 7.93,15.04 7.67,14.79 5.77,14.79 5.77,15.55 C2.1 4.88,16.41 3.76,16.41 3.76,13.96 L4.1 | 7.8,17.33 9.45,17.33 U1.A27 | 7.8,17.33 7.8,21.26 7.93,21.39 10.09,21.39 11.1,20.37 11.1,18.6 10.85,18.34 U1.G31
N$9  (via drill 0.3)
  Top 0.127: U1.A15 9.36,14.8 9.33,14.8 9.05,14.52 9.05,14.41 8.46,14.41 7.23,13.17 v6.99,13.17 | L3.1 4.62,11.12 C1.1 5.79,12.3 v6.35,12.3
  Bottom 0.127: v6.99,13.17 6.35,12.54 v6.35,12.3
N$10
  Top 0.127: U1.C31 10.09,18.34 10.09,19.36 10.34,19.61 10.34,20.25 9.83,20.75 X1.2
N$11
  Top 0.127: X1.4 8.44,19.87 8.44,18.27 8.82,17.88 9.84,17.88 U1.B30
N$12
  Top 0.254: U1.L31 11.65,18.81
  Top 0.381: 11.65,19.73 L5.2
  Top 0.508: 11.65,18.81 11.65,19.73 | L5.2 C8.2 arc90 C8.2
N$13
  Top 0.381: 11.68,23.03 X2.FP
  Top 0.508: X2.FP arc-90 11.68,23.03 L5.1 12.88,20.86 arc-90 C9.1
N$14
  Top 0.127: C15.2 17.71,2.21 17.71,2.59 17.83,2.72 17.83,3.61 U5.12
N$15
  Top 0.127: U5.8 16.18,3.61 16.18,3.23 15.8,2.85 13.26,2.85 12.25,1.83 Y1.2
N$16
  Top 0.127: Y1.1 15.6,2.59 15.91,2.59 16.59,3.28 U5.9
RESET  (via drill 0.3)
  Top 0.127: v20.25,18.98 14.66,18.98 14.15,18.47 14.15,18.34 U1.AC31
  Bottom 0.127: v20.25,18.98 21.64,18.98 J9.P$1
RST  (via drill 0.3)
  Top 0.127: v20.37,9.71 20.12,9.71 16.95,12.88 15.93,12.88 U1.AL5 | v14.15,9.45 15.17,8.44 15.17,7.67 15.04,7.55 13.64,7.55 13.39,7.29 13.39,6.66 13.52,6.53 14.15,6.53 14.41,6.28 14.41,5.26 14.28,5.13 | 14.28,5.13 14.02,4.88 R7.1 | 14.28,5.13 15.04,4.37 15.42,4.37 U5.6
  Bottom 0.127: v20.37,9.71 20.37,9.2 19.48,8.31 17.96,8.31 16.82,9.45 v14.15,9.45
SCL
  Top 0.127: U1.AE1 14.53,11.87 14.53,9.71 15.68,8.56 15.68,8.05 R4.1 15.8,7.93 16.18,7.55 16.18,6.66 U5.24
SDA
  Top 0.127: U1.AJ1 15.29,11.87 16.06,11.1 16.06,8.69 16.69,8.05 R1.1 16.69,7.93 16.69,6.66 U5.23
SEN_SCL  (via drill 0.3)
  Top 0.127: 9.58,7.67 9.58,6.91 U2.2 | 9.58,7.67 9.58,8.18 R2.2 | 9.58,7.67 v10.09,7.67 | U5.14 18.55,4.46 18.88,4.46 18.99,4.57 18.99,4.79 19.68,5.47 19.68,6.64 v18.44,7.88
  Bottom 0.127: v10.09,7.67 11.36,8.94 16.97,8.94 17.86,8.05 18.26,8.05 v18.44,7.88
SEN_SDA  (via drill 0.3)
  Top 0.127: 8.44,7.8 8.44,7.17 8.69,6.91 U2.3 | 8.44,7.8 8.44,8.18 R3.2 | v16.56,9.96 18.09,9.96 21.52,6.53 21.52,5.13 20.37,3.99 18.47,3.99 U5.13 | 8.44,7.8 v8.94,7.8
  Bottom 0.127: v16.56,9.96 11.1,9.96 v8.94,7.8
SW  (via drill 0.3)
  Top 0.127: v17.58,14.79 17.45,14.91 15.93,14.91 U1.AL15
  Bottom 0.127: v17.58,14.79 17.07,14.79 12.5,10.21 10.72,10.21 8.44,7.93 8.44,7.67 9.2,6.91 10.47,6.91 S1.4 10.6,6.91 11.61,7.93 13.64,7.93 14.66,6.91 S1.1
SWDCLK
  Top 0.127: J10.P$1
  Top 0.152: U1.W31 13.34,18.38 13.34,18.43 13.45,18.54 13.47,18.58 13.49,18.58 13.52,18.61 13.54,18.61 16.31,21.39 J10.P$1
SWDIO
  Top 0.127: U1.AA31 13.64,18.34 15.42,20.12 20.63,20.12 J11.P$1